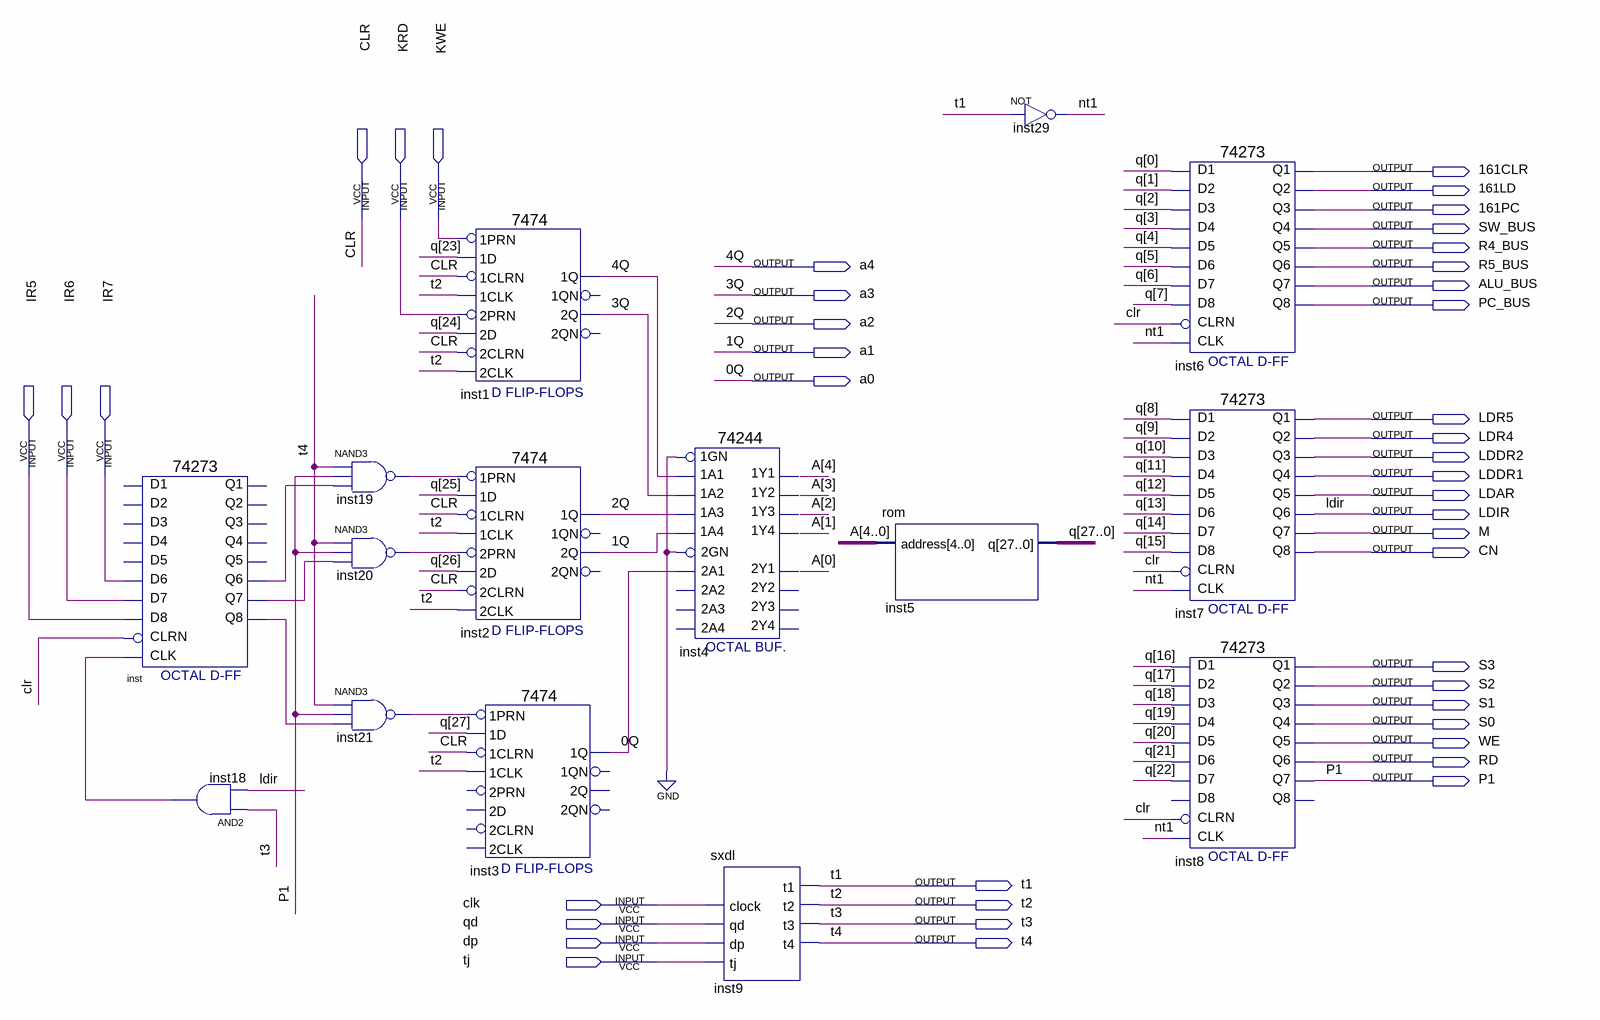
[diagram p0: schematic sheet]
// Quartus schematic KZQ.bdf as structural Verilog: 15 symbols, 42 pins
module KZQ (
  input  CLR,
  input  KRD,
  input  KWE,
  input  IR5,
  input  IR6,
  input  IR7,
  input  clk,
  input  qd,
  input  dp,
  input  tj,
  output \161CLR ,
  output \161LD ,
  output \161PC ,
  output SW_BUS,
  output R4_BUS,
  output a4,
  output R5_BUS,
  output ALU_BUS,
  output a3,
  output PC_BUS,
  output a2,
  output a1,
  output a0,
  output LDR5,
  output LDR4,
  output LDDR2,
  output LDDR1,
  output LDAR,
  output LDIR,
  output M,
  output CN,
  output S3,
  output S2,
  output S1,
  output S0,
  output WE,
  output RD,
  output P1,
  output t1,
  output t2,
  output t3,
  output t4
);

  wire inst18_out, inst19_out, inst20_out, inst21_out, inst_q6, inst_q7, inst_q8, nt1;
  wire [27:0] q;

  \74273  inst (
    .D7(IR6), .D6(IR7), .D8(IR5), .CLK(inst18_out), .CLRN(CLR), .Q6(inst_q6), .Q7(inst_q7), .Q8(inst_q8));  // open: D2, D3, D1, D4, D5, Q4, Q1, Q2, Q3, Q5
  and inst18 (inst18_out, t3, LDIR);
  nand inst19 (inst19_out, t4, P1, inst_q6);
  nand inst20 (inst20_out, t4, P1, inst_q7);
  nand inst21 (inst21_out, t4, P1, inst_q8);
  \7474  inst1 (
    .\2D (q[24]), .\2PRN (KRD), .\1CLK (t2), .\1D (q[23]), .\1PRN (KWE), .\2CLK (t2), .\2CLRN (CLR),
    .\1CLRN (CLR), .\2Q (a3), .\1Q (a4));  // open: 1QN, 2QN
  \7474  inst2 (
    .\2D (q[26]), .\2PRN (inst20_out), .\1CLK (t2), .\1D (q[25]), .\1PRN (inst19_out), .\2CLK (t2),
    .\2CLRN (CLR), .\1CLRN (CLR), .\2Q (a1), .\1Q (a2));  // open: 1QN, 2QN
  \7474  inst3 (
    .\1CLK (t2), .\1D (q[27]), .\1PRN (inst21_out), .\1CLRN (CLR), .\1Q (a0));  // open: 2D, 2PRN, 2CLK, 2CLRN, 1QN, 2Q, 2QN
  \74244  inst4 (
    .\1A2 (a3), .\1A4 (a1), .\1A1 (a4), .\1A3 (a2), .\1GN (1'b0), .\2GN (1'b0), .\2A1 (a0), .\1Y2 (a3),
    .\1Y4 (a1), .\2Y1 (a0), .\1Y1 (a4), .\1Y3 (a2));  // open: 2A3, 2A4, 2A2, 2Y3, 2Y4, 2Y2
  sxdl inst9 (.clock(clk), .qd(qd), .dp(dp), .tj(tj), .t1(t1), .t2(t2), .t3(t3), .t4(t4));
  rom inst5 (.address({a4, a3, a2, a1, a0}), .q(q));
  not inst29 (nt1, t1);
  \74273  inst6 (
    .D2(q[1]), .D3(q[2]), .D1(q[0]), .D4(q[3]), .D7(q[6]), .D6(q[5]), .D5(q[4]), .D8(q[7]), .CLK(nt1),
    .CLRN(CLR), .Q4(SW_BUS), .Q1(\161CLR ), .Q2(\161LD ), .Q3(\161PC ), .Q6(R5_BUS), .Q5(R4_BUS),
    .Q7(ALU_BUS), .Q8(PC_BUS));
  \74273  inst7 (
    .D2(q[9]), .D3(q[10]), .D1(q[8]), .D4(q[11]), .D7(q[14]), .D6(q[13]), .D5(q[12]), .D8(q[15]), .CLK(nt1),
    .CLRN(CLR), .Q4(LDDR1), .Q1(LDR5), .Q2(LDR4), .Q3(LDDR2), .Q6(LDIR), .Q5(LDAR), .Q7(M), .Q8(CN));
  \74273  inst8 (
    .D2(q[17]), .D3(q[18]), .D1(q[16]), .D4(q[19]), .D7(q[22]), .D6(q[21]), .D5(q[20]), .CLK(nt1),
    .CLRN(CLR), .Q4(S0), .Q1(S3), .Q2(S2), .Q3(S1), .Q6(RD), .Q5(WE), .Q7(P1));  // open: D8, Q8

  // Other names for the same wires on the sheet: 0Q = a0; 1Q = a1; 2Q = a2; 3Q = a3; 4Q = a4
endmodule
